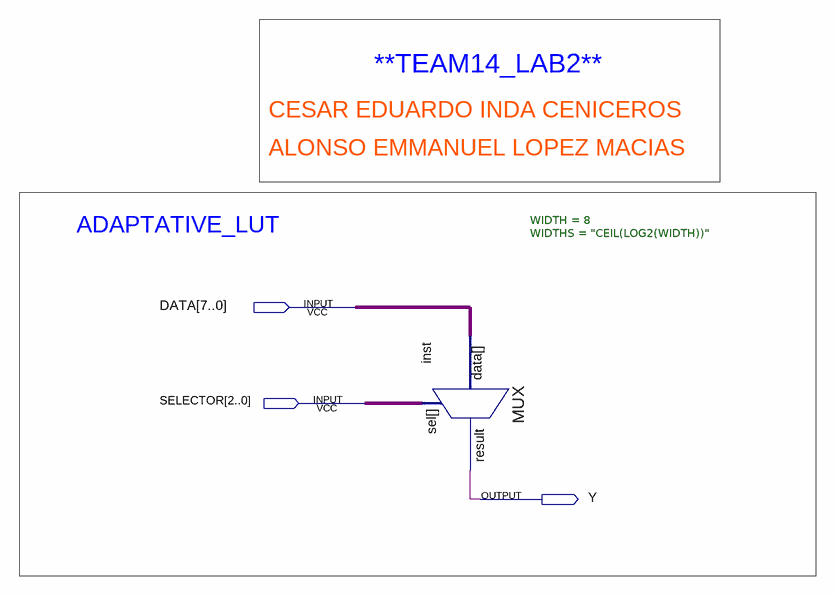
[diagram p0: schematic sheet]
// Quartus schematic AdaptativeLUT.bdf as structural Verilog: 1 symbols, 3 pins
module AdaptativeLUT (
  input  [7:0] DATA,
  input  [2:0] SELECTOR,
  output Y
);

  MUX #(.WIDTH(8), .WIDTHS("CEIL(LOG2(WIDTH))")) inst (.data(DATA), .sel(SELECTOR), .result(Y));

  // Notes on the sheet:
  //   **TEAM14_LAB2**
  //   CESAR EDUARDO INDA CENICEROS
  //   ALONSO EMMANUEL LOPEZ MACIAS
  //   ADAPTATIVE_LUT
endmodule
